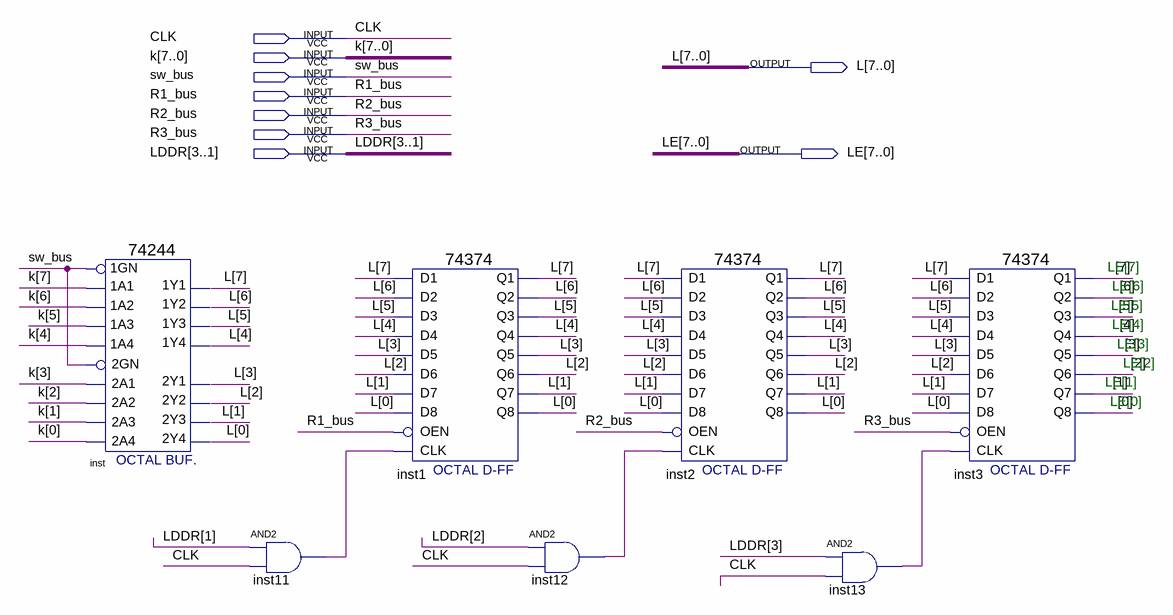
[diagram p0: schematic sheet]
// Quartus schematic zjw_zongxian.bdf as structural Verilog: 7 symbols, 9 pins
module zjw_zongxian (
  input  CLK,
  input  [7:0] k,
  input  sw_bus,
  input  R1_bus,
  input  R2_bus,
  input  R3_bus,
  input  [3:1] LDDR,
  output [7:0] L,
  output [7:0] LE
);

  wire inst11_out, inst12_out, inst13_out;

  \74244  inst (
    .\1A2 (k[6]), .\1A4 (k[4]), .\1A1 (k[7]), .\1A3 (k[5]), .\1GN (sw_bus), .\2A3 (k[1]), .\2GN (sw_bus),
    .\2A1 (k[3]), .\2A4 (k[0]), .\2A2 (k[2]), .\1Y2 (L[6]), .\1Y4 (L[4]), .\2Y1 (L[3]), .\1Y1 (L[7]),
    .\2Y3 (L[1]), .\2Y4 (L[0]), .\1Y3 (L[5]), .\2Y2 (L[2]));
  and inst11 (inst11_out, LDDR[1], CLK);
  \74374  inst1 (
    .D1(L[7]), .D2(L[6]), .D3(L[5]), .D4(L[4]), .D6(L[2]), .D5(L[3]), .OEN(R1_bus), .D8(L[0]), .D7(L[1]),
    .CLK(inst11_out), .Q2(L[6]), .Q3(L[5]), .Q5(L[3]), .Q4(L[4]), .Q6(L[2]), .Q7(L[1]), .Q8(L[0]), .Q1(L[7]));
  and inst12 (inst12_out, LDDR[2], CLK);
  \74374  inst2 (
    .D1(L[7]), .D2(L[6]), .D3(L[5]), .D4(L[4]), .D6(L[2]), .D5(L[3]), .OEN(R2_bus), .D8(L[0]), .D7(L[1]),
    .CLK(inst12_out), .Q2(L[6]), .Q3(L[5]), .Q5(L[3]), .Q4(L[4]), .Q6(L[2]), .Q7(L[1]), .Q8(L[0]), .Q1(L[7]));
  and inst13 (inst13_out, LDDR[3], CLK);
  \74374  inst3 (
    .D1(L[7]), .D2(L[6]), .D3(L[5]), .D4(L[4]), .D6(L[2]), .D5(L[3]), .OEN(R3_bus), .D8(L[0]), .D7(L[1]),
    .CLK(inst13_out), .Q2(L[6]), .Q3(L[5]), .Q5(L[3]), .Q4(L[4]), .Q6(L[2]), .Q7(L[1]), .Q8(L[0]), .Q1(L[7]));

  // Notes on the sheet:
  //   LE[7]
  //   LE[6]
  //   LE[5]
  //   LE[4]
  //   LE[3]
  //   LE[2]
  //   LE[1]
  //   LE[0]
endmodule
